# Altium schematic sheet Kanaloa_v2.0.0_Power.SchDoc
size A
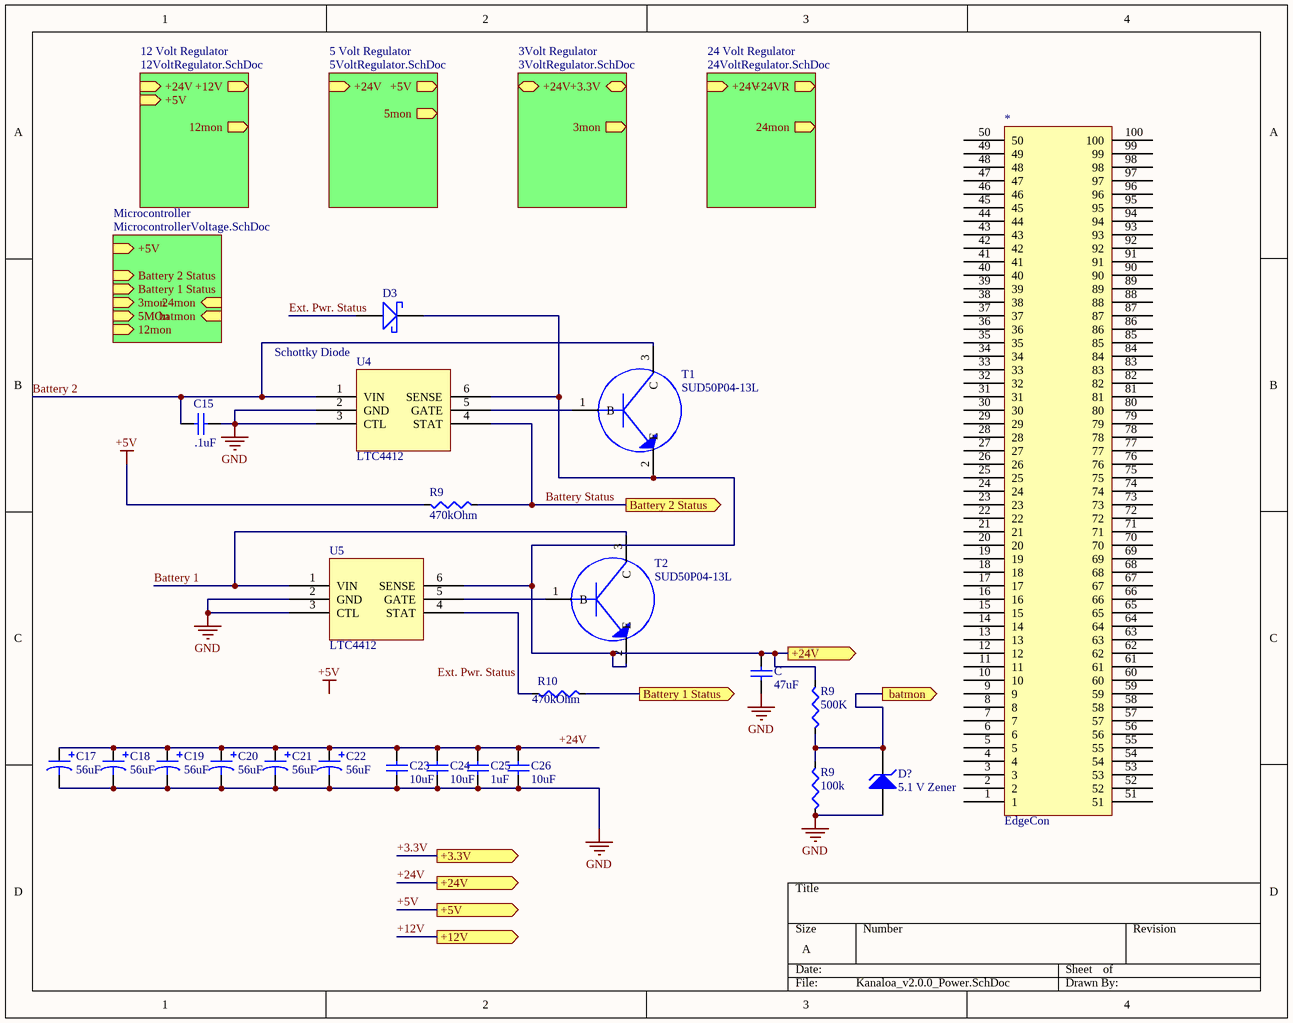
[diagram p0: Kanaloa_v2.0.0_Power.SchDoc]

## Parts
(Parts that share a designator on the sheet are numbered #1, #2 ... from top to bottom, then left to right.)
*  EdgeCon  [5645235-3 CON]
C  47uF  [1210 (3225) Capacitor]
C15  .1uF  [0805 (2012) Capacitor]
C17  56uF  [Radial_8mmDia_SM_E]
C18  56uF  [Radial_8mmDia_SM_E]
C19  56uF  [Radial_8mmDia_SM_E]
C20  56uF  [Radial_8mmDia_SM_E]
C21  56uF  [Radial_8mmDia_SM_E]
C22  56uF  [Radial_8mmDia_SM_E]
C23  10uF  [0805 (2012) Capacitor]
C24  10uF  [0805 (2012) Capacitor]
C25  1uF  [0805 (2012) Capacitor]
C26  10uF  [0805 (2012) Capacitor]
D3  Schottky Diode  [DO-41]
D?  5.1 V Zener  [DIODE-0.7]
R9#1  470kOhm  [R 0805 (2012) RESISTOR]
R9#2  500K  [R 0805 (2012) RESISTOR]
R9#3  100k  [R 0805 (2012) RESISTOR]
R10  470kOhm  [R 0805 (2012) RESISTOR]
T1  SUD50P04-13L  [SOT23]
T2  SUD50P04-13L  [SOT23]
U4  LTC4412  [SOT95P245X110-6N]
U5  LTC4412  [SOT95P245X110-6N]

## Sub-sheets
3Volt Regulator = 3VoltRegulator.SchDoc: +24V, +3.3V, 3mon (out)
5 Volt Regulator = 5VoltRegulator.SchDoc: +24V (in), +5V (out), 5mon (out)
12 Volt Regulator = 12VoltRegulator.SchDoc: +24V (in), +12V (out), +5V (in), 12mon (out)
24 Volt Regulator = 24VoltRegulator.SchDoc: +24V (in), +24VR (out), 24mon (out)
Microcontroller = MicrocontrollerVoltage.SchDoc: +5V (in), Battery 2 Status (in), Battery 1 Status (in), 3mon (in), 5MOn (in), 12mon (in), 24mon (in), batmon (in)

## Ports
+3.3V (out), +5V (out), +12V (out), +24V (out), batmon (out), Battery 1 Status (out), Battery 2 Status (out)

## Nets
+5V: R9#1.2 ; port +5V
GND: C.1 C15.2 C17.N C18.N C19.N C20.N C21.N C22.N C23.2 C24.2 C25.2 C26.2 D?.1(A) R9#3.1 U4.2(GND) U4.3(CTL) U5.2(GND) U5.3(CTL)
+3.3V: port +3.3V
+12V: port +12V
+24V: C.2 C17.P C18.P C19.P C20.P C21.P C22.P C23.1 C24.1 C25.1 C26.1 D3.K R9#2.2 T1.2(E) T2.2(E) U4.6(SENSE) U5.6(SENSE) ; port +24V
batmon: D?.2(K) R9#2.1 R9#3.2 ; port batmon
Battery 1: T2.3(C) U5.1(VIN)
Battery 1 Status: R10.1 ; port Battery 1 Status
Battery 2: C15.1 T1.3(C) U4.1(VIN)
Battery Status: R9#1.1 U4.4(STAT) ; port Battery 2 Status
Ext. Pwr. Status: D3.A
NetR10_2: R10.2 U5.4(STAT)
NetT1_1: T1.1(B) U4.5(GATE)
NetT2_1: T2.1(B) U5.5(GATE)

Not connected (* = marked no-connect by the designer): * 1 2 3 4 5 6 7 8 9 10 11 12 13 14 15 16 17 18 19 20 21 22 23 24 25 26 27 28 29 30 31 32 33 34 35 36 37 38 39 40 41 42 43 44 45 46 47 48 49 50 51 52 53 54 55 56 57 58 59 60 61 62 63 64 65 66 67 68 69 70 71 72 73 74 75 76 77 78 79 80 81 82 83 84 85 86 87 88 89 90 91 92 93 94 95 96 97 98 99 100

## Notes on the sheet
- Labels drawn without touching a wire or pin: +5V, Ext. Pwr. Status

## Library data of the parts
C C23-C26 = Capacitor (non-polarized): Capacitor; Value: .1uF
C15 = Capacitor (non-polarized): Capacitor; Value: .1uF
C17-C22 = Capacitor (polarized)
D? = D Zener: Zener Diode; Published: 8-Jun-2000; LatestRevisionDate: 17-Jul-2002; LatestRevisionNote: Re-released for DXP Platform.; PackageReference: DIODE-0.7; Publisher: Altium Limited; PackageDescription: Diode, Thru-Hole; 2 Leads; 0.7 in Pin Spacing
R9#1-R9#3 R10 = Resistor: Value: 0Ohm
T1 T2 = Transistor
U4 U5 = LTC4412: Low Loss Power Path Controller in Thin SOT